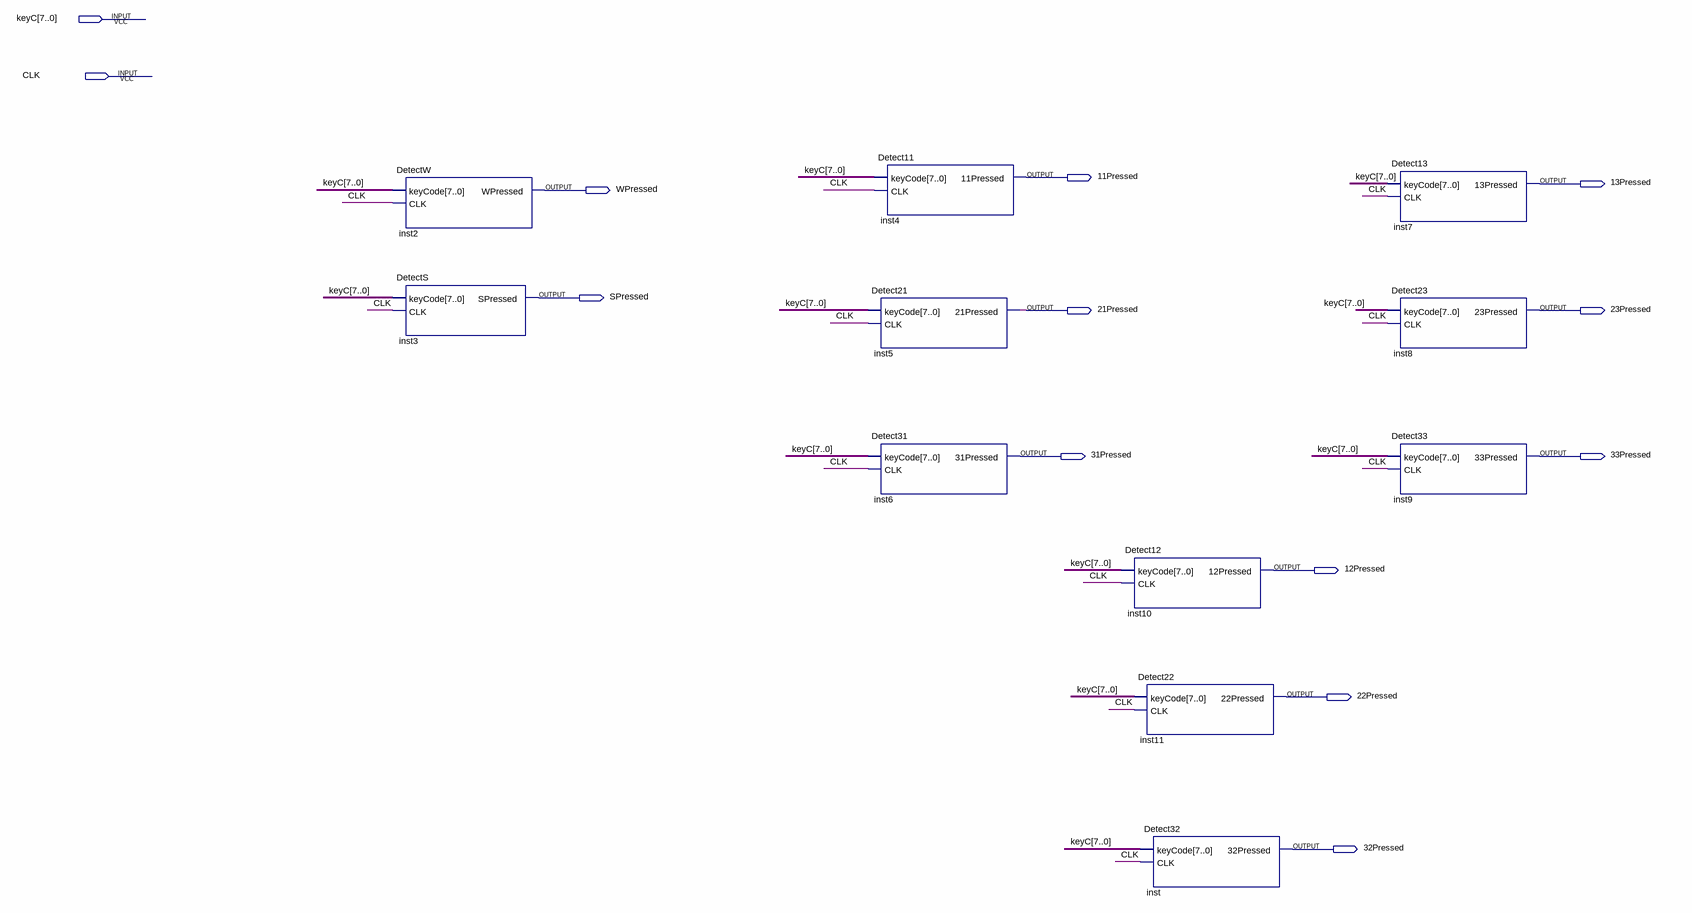
[diagram p0: schematic sheet]
// Quartus schematic MyKeyDetector.bdf as structural Verilog: 11 symbols, 13 pins
module MyKeyDetector (
  input  [7:0] keyC,
  input  CLK,
  output \11Pressed ,
  output \13Pressed ,
  output WPressed,
  output SPressed,
  output \21Pressed ,
  output \23Pressed ,
  output \31Pressed ,
  output \33Pressed ,
  output \12Pressed ,
  output \22Pressed ,
  output \32Pressed 
);

  DetectW inst2 (.keyCode(keyC), .CLK(CLK), .WPressed(WPressed));
  DetectS inst3 (.keyCode(keyC), .CLK(CLK), .SPressed(SPressed));
  Detect11 inst4 (.keyCode(keyC), .CLK(CLK), .\11Pressed (\11Pressed ));
  Detect21 inst5 (.keyCode(keyC), .CLK(CLK), .\21Pressed (\21Pressed ));
  Detect31 inst6 (.keyCode(keyC), .CLK(CLK), .\31Pressed (\31Pressed ));
  Detect12 inst10 (.keyCode(keyC), .CLK(CLK), .\12Pressed (\12Pressed ));
  Detect22 inst11 (.keyCode(keyC), .CLK(CLK), .\22Pressed (\22Pressed ));
  Detect32 inst (.keyCode(keyC), .CLK(CLK), .\32Pressed (\32Pressed ));
  Detect13 inst7 (.keyCode(keyC), .CLK(CLK), .\13Pressed (\13Pressed ));
  Detect23 inst8 (.keyCode(keyC), .CLK(CLK), .\23Pressed (\23Pressed ));
  Detect33 inst9 (.keyCode(keyC), .CLK(CLK), .\33Pressed (\33Pressed ));
endmodule
